# Altium schematic sheet sch_cm4_sd_card.SchDoc
size A4; SheetNumber: 6; SheetTotal: 7
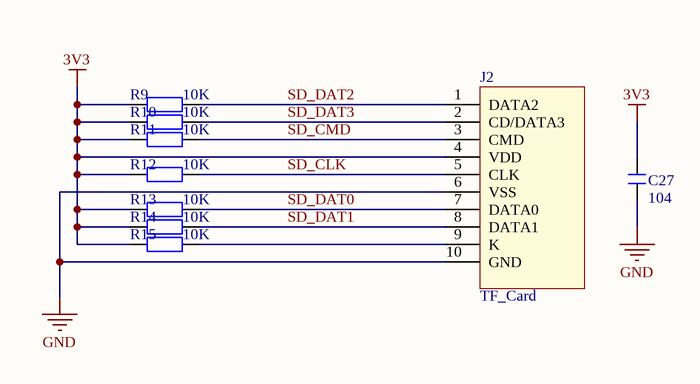
[diagram p0: sch_cm4_sd_card.SchDoc]

## Parts
C27  104  [C 0402_L]
J2  TF_Card  [Micro SD]
R9  10K  [R 0402_L]
R10  10K  [R 0402_L]
R11  10K  [R 0402_L]
R12  10K  [R 0402_L]
R13  10K  [R 0402_L]
R14  10K  [R 0402_L]
R15  10K  [R 0402_L]

## Nets
3V3: C27.2 J2.4(VDD) R9.1 R10.1 R11.1 R12.1 R13.1 R14.1 R15.1
GND: C27.1 J2.6(VSS) J2.10(GND)
SD_CLK: J2.5(CLK) R12.2
SD_CMD: J2.3(CMD) R11.2
SD_DAT0: J2.7(DATA0) R13.2
SD_DAT1: J2.8(DATA1) R14.2
SD_DAT2: J2.1(DATA2) R9.2
SD_DAT3: J2.2(CD/DATA3) R10.2
NetJ2_9: J2.9(K) R15.2

## Library data of the parts
C27 = C: 贴片电容; BOM名称: 无极性贴片电容; 淘宝ID: 封装库来自淘宝 ID：黄晶宝石; 联系售后，技术支持: https://shop463601444.taobao.com; 唯一出售店铺网址: https://shop463601444.taobao.com
J2 = TF_Card: TF卡座; BOM名称: TF卡座; 学习资源: https://shop463601444.taobao.com
R9-R15 = R: 贴片电阻; 版权归属: 来自淘宝 ID：黄晶宝石; 封装库来自淘宝卖家 ID：黄晶宝石: 其他店铺购入均为盗版，不享受售后技术支持服务，请立即申请退款; BOM名称: 贴片电阻; 联系售后: https://item.taobao.com/item.htm?id=566775463719